# Altium schematic sheet chernov_motherboard.SchDoc: =title_line_1 + title_line_2
size 594 x 420 mm; SheetNumber: 1
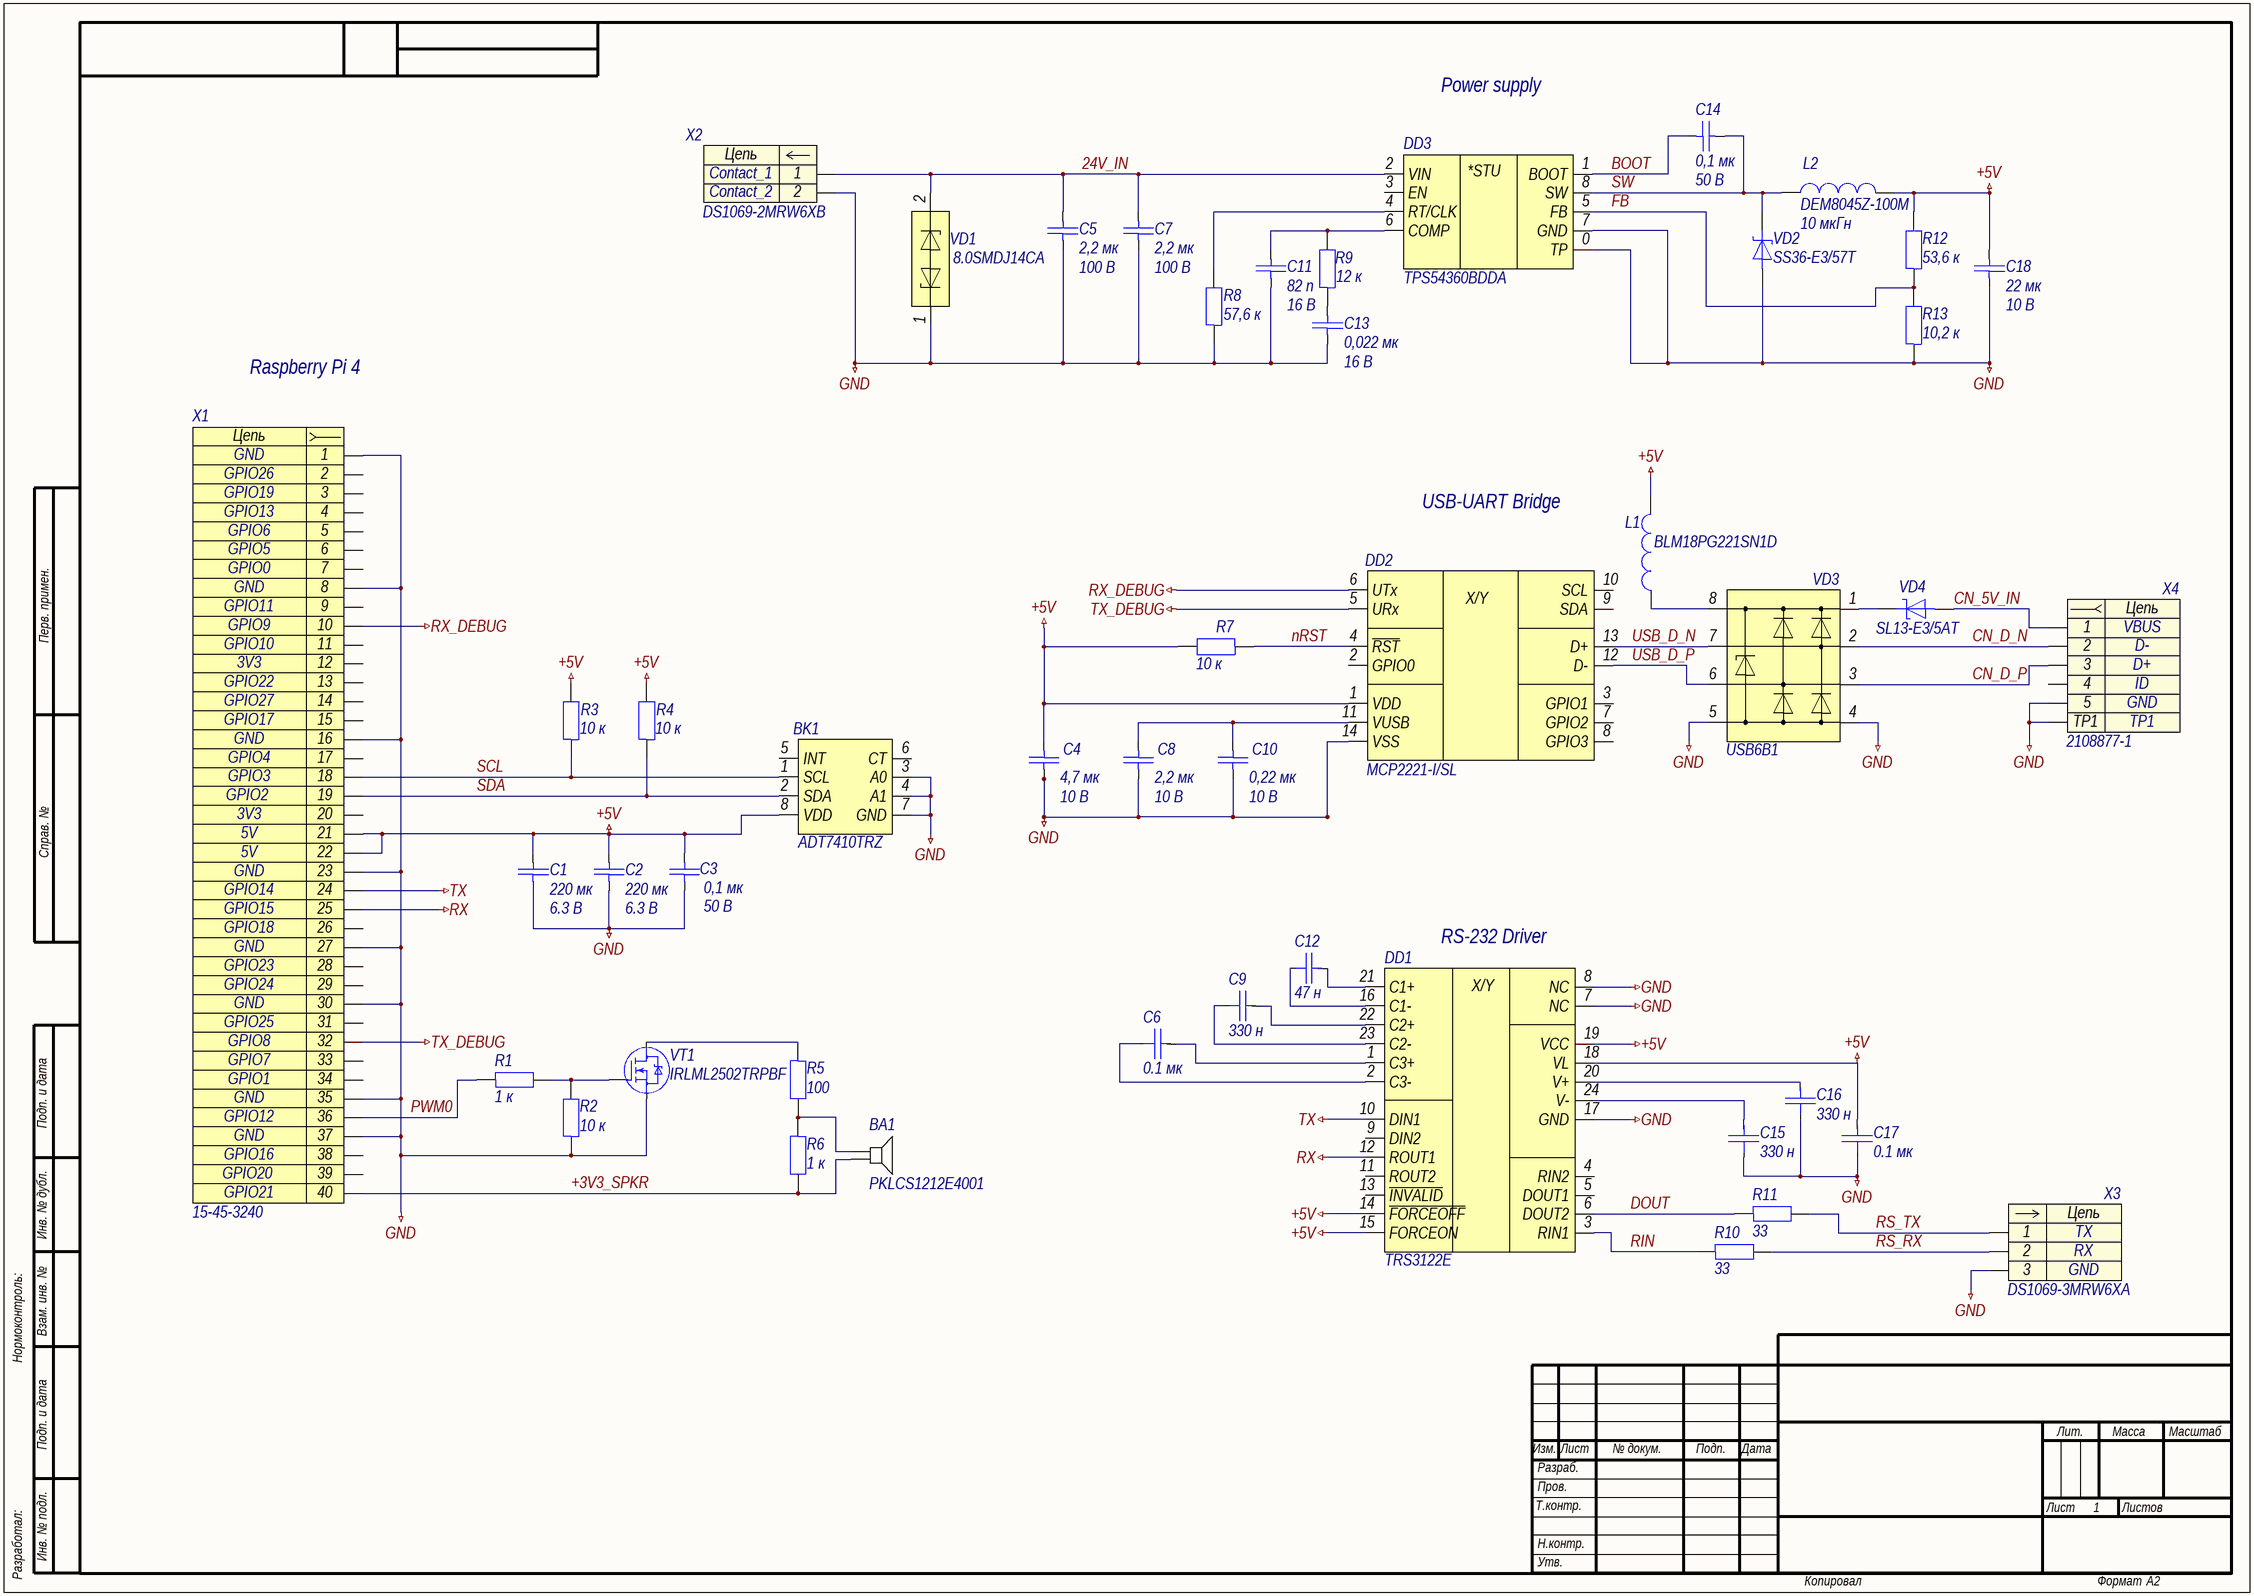
[diagram p0: chernov_motherboard.SchDoc]

## Parts
BA1  PKLCS1212E4001  [PKLCS1212E4001]
BK1  ADT7410TRZ  [SOIC-8-P127-490X390X175-L84X41]
C1  220 мк  Напряжение: 6.3 В  [C1210]
C2  220 мк  Напряжение: 6.3 В  [C1210]
C3  0,1 мк  Напряжение: 50 В  [C0603]
C4  4,7 мк  Напряжение: 10 В  [C0603]
C5  2,2 мк  Напряжение: 100 В  [C1206]
C6  0.1 мк  [C0603]
C7  2,2 мк  Напряжение: 100 В  [C1206]
C8  2,2 мк  Напряжение: 10 В  [C0603]
C9  330 н  [C0805]
C10  0,22 мк  Напряжение: 10 В  [C0603]
C11  82 п  Напряжение: 16 В  [C0603]
C12  47 н  [C0603]
C13  0,022 мк  Напряжение: 16 В  [C0603]
C14  0,1 мк  Напряжение: 50 В  [C0603]
C15  330 н  [C0805]
C16  330 н  [C0805]
C17  0.1 мк  [C0603]
C18  22 мк  Напряжение: 10 В  [C0603]
DD1  TRS3122E  [PQFN_24]
DD2  MCP2221-I/SL  [SOIC127P600X175-14N]
DD3  TPS54360BDDA  [HSOIC-8]
L1  BLM18PG221SN1D  [BLM-2-0603]
L2  DEM8045Z-100M  Индуктивность: 10 мкГн  [DEM-2-800X800X450]
R1  1 к  [R0603]
R2  10 к  [R0603]
R3  10 к  [R0603]
R4  10 к  [R0603]
R5  100  [R0603]
R6  1 к  [R0603]
R7  10 к  [R0603]
R8  57,6 к  [R0603]
R9  12 к  [R0603]
R10  33  [R0603]
R11  33  [R0603]
R12  53,6 к  [R0603]
R13  10,2 к  [R0603]
VD1  8.0SMDJ14CA  [DO-214AB]
VD2  SS36-E3/57T  [DO-214AB]
VD3  USB6B1  [SO-8]
VD4  SL13-E3/5AT  [DO-214AC]
VT1  IRLML2502TRPBF  [SOT-23-3-P95-292X237X112]
X1  15-45-3240  [15-45-3240]
X2  DS1069-2MRW6XB  [DS1069-2MRW6XB]
X3  DS1069-3MRW6XA  [DS1069-3MRW6XA]
X4  2108877-1  [2108877-1]

## Nets
+5V: BK1.8(VDD) C1.1 C2.1 C3.1 C4.2 C17.2 C18.1 DD1.14(~{FORCEOFF}) DD1.15(FORCEON) DD1.18(VL) DD1.19(VCC) DD2.1(VDD) L1.1 L2.2 R3.2 R4.2 R7.2 R12.2 X1.21 X1.22
GND: BK1.3(A0) BK1.4(A1) BK1.7(GND) C1.2 C2.2 C3.2 C4.1 C5.2 C7.2 C8.1 C10.1 C11.2 C13.2 C15.1 C16.1 C17.1 C18.2 DD1.7(NC) DD1.8(NC) DD1.17(GND) DD2.14(VSS) DD3.0(TP) DD3.7(GND) R2.1 R8.1 R13.1 VD1.1 VD2.2 VD3.4 VD3.5 VT1.S X1.1 X1.8 X1.16 X1.23 X1.27 X1.30 X1.35 X1.37 X2.2 X3.3 X4.5 X4.TP1
RX: DD1.12(ROUT1) X1.25
RX_DEBUG: DD2.6(UTx) X1.10
TX: DD1.10(DIN1) X1.24
TX_DEBUG: DD2.5(URx) X1.32
24V_IN: C5.1 C7.1 DD3.2(VIN) VD1.2 X2.1
+3V3_SPKR: BA1.2 R6.2 X1.40
BOOT: C14.2 DD3.1(BOOT)
CN_5V_IN: VD4.2 X4.1
CN_D_N: VD3.2 X4.2
CN_D_P: VD3.3 X4.3
DOUT: DD1.6(DOUT2) R11.1
FB: DD3.5(FB) R12.1 R13.2
nRST: DD2.4(~{RST}) R7.1
PWM0: R1.1 X1.36
RIN: DD1.3(RIN1) R10.1
RS_RX: R10.2 X3.2
RS_TX: R11.2 X3.1
SCL: BK1.1(SCL) R3.1 X1.18
SDA: BK1.2(SDA) R4.1 X1.19
SW: C14.1 DD3.8(SW) L2.1 VD2.1
USB_D_N: DD2.13(D+) VD3.7
USB_D_P: DD2.12(D-) VD3.6
NetBA1_1: BA1.1 R5.2 R6.1
NetC6_1: C6.1 DD1.2(C3-)
NetC6_2: C6.2 DD1.1(C3+)
NetC8_2: C8.2 C10.2 DD2.11(VUSB)
NetC9_1: C9.1 DD1.23(C2-)
NetC9_2: C9.2 DD1.22(C2+)
NetC11_1: C11.1 DD3.6(COMP) R9.2
NetC12_1: C12.1 DD1.16(C1-)
NetC12_2: C12.2 DD1.21(C1+)
NetC13_1: C13.1 R9.1
NetC15_2: C15.2 DD1.24(V-)
NetC16_2: C16.2 DD1.20(V+)
NetDD3_4: DD3.4(RT/CLK) R8.2
NetL1_2: L1.2 VD3.8
NetR1_2: R1.2 R2.2 VT1.G
NetR5_1: R5.1 VT1.D
NetVD3_1: VD3.1 VD4.1

Not connected (* = marked no-connect by the designer): BK1 5(INT) 6(CT); DD1 4(RIN2) 5(DOUT1) 9(DIN2) 11(ROUT2) 13(~{INVALID}); DD2 2(GPIO0) 3(GPIO1) 7(GPIO2) 8(GPIO3) 9(SDA) 10(SCL); DD3 3(EN); X1 2 3 4 5 6 7 9 11 12 13 14 15 17 20 26 28 29 33 34 38 39; X4 4

## Notes on the sheet
- Power supply
- Raspberry Pi 4
- USB-UART Bridge
- (near DD1) RS-232 Driver
- Перв. примен.
- Справ. №
- Подп. и дата
- Инв. № дубл.
- Нормоконтроль:
- Взам. инв. №
- Изм.
- Лист
- № докум.
- Подп.
- Дата
- Лит.
- Масса
- Масштаб
- Т.контр.
- Пров.
- Разраб.
- Листов
- Разработал:
- Инв. № подл.
- Н.контр.
- Утв.
- Копировал
- Формат
- А2
- (in symbol dd0002) *STU
- (in symbol MCP2221-I/SL) X/Y
- (in symbol TRS3122E) X/Y
- (in symbol x0001) Цепь
- (in symbol x0023) Цепь
- (in symbol x0039) Цепь
- (in symbol x0054) Цепь; 31

## Library data of the parts
BA1 = PKLCS1212E4001: Piezoelectric Sounders External Drive SMD Type; URL: http://www.farnell.com/datasheets/2157985.pdf
BK1 = TEMP: 16-бит I2CI цифровой датчик температуры, точность ±0.5°C
C1 C2 = c0158: =Описание; ID: c0158; Фамилия: Шкабара; Описание: Конденсатор керамический чип 1210 220 мкФ 6.3 В ±10 %; Наименование: CC1210KRX5R5BB227; Производитель: YAGEO Corp.; Отклонение: ±10 %; Рабочие температуры: от –55 °С до +85 °С; Температурный коэффициент емкости: X5R; Корпус: 1210; Номинал: 220 мк; Номинальное напряжение: 6.3 В; HelpURL: https://www.yageo.com/upload/media/product/productsearch/datasheet/mlcc/UPY-GPHC_X5R_4V-to-50V_26.pdf
C3 = c0088: =Описание; ID: c0088; Фамилия: Паньков; Описание: Конденсатор керамический чип 0603 100 нФ 50 В ±10 %; Наименование: CC0603KRX7R9BB104; Производитель: YAGEO Corp.; Отклонение: ±10 %; Рабочие температуры: от –55 °С до +125 °С; Температурный коэффициент емкости: X7R; Корпус: 0603; Номинал: 0,1 мк; Номинальное напряжение: 50 В; HelpURL: https://www.yageo.com/upload/media/product/productsearch/datasheet/mlcc/UPY-GPHC_X7R_6.3V-to-50V_20.pdf
C4 = c0012: =Описание; ID: c0012; Фамилия: Чернов; Описание: Конденсатор чип 0603 4,7 мкФ 10 В ±10 %; Наименование: CC0603KRX5R6BB475; Производитель: Yageo; Отклонение: ±10 %; Рабочие температуры: от -55 °С до +85 °С; Корпус: 0603; Номинал: 4,7 мк; Номинальное напряжение: 10 В; HelpURL: https://www.yageo.com/upload/media/product/productsearch/datasheet/mlcc/UPY-GPHC_X5R_4V-to-50V_26.pdf
C5 C7 = c0068: =Описание; ID: c0068; Фамилия: Ларионов; Описание: Конденсатор чип 1206 2,2 мкФ 100 В ±10 %; Наименование: CC1206KKX7R0BB225; Производитель: YAGEO Corp.; Отклонение: ±10 %; Рабочие температуры: от –55 °С до +125 °С; ТКЕ: X7R; Корпус: 1206; Номинал: 2,2 мк; Номинальное напряжение: 100 В; HelpURL: https://www.yageo.com/upload/media/product/productsearch/datasheet/mlcc/UPY-NP0X7R_MV_100-to-630V_22.pdf
C6 C17 = c0002: =Описание; ID: c0002; Фамилия: Жернаков; Описание: Конденсатор; Наименование: CL10B104JB8NNNC; Производитель: Samsung electro-mechanics; Отклонение: ±5 %; Номинальное напряжение: 50 В; Рабочие температуры: от -55 °С до +125 °С; Корпус: 0603; Номинал: 0.1 мк; HelpURL: http://product.samsungsem.com/mlcc/CL10B104JB8NNN.do
C8 = c0009: =Описание; ID: c0009; Фамилия: Чернов; Описание: Конденсатор чип 0603 2,2 мкФ 10 В ±10 %; Наименование: CC0603KRX7R6BB225; Производитель: Yageo; Отклонение: ±10 %; Рабочие температуры: от -55 °С до +125 °С; Корпус: 0603; Номинал: 2,2 мк; Номинальное напряжение: 10 В; HelpURL: https://www.yageo.com/upload/media/product/productsearch/datasheet/mlcc/UPY-GPHC_X7R_6.3V-to-50V_20.pdf
C9 C15 C16 = c0003: =Описание; ID: c0003; Фамилия: Жернаков; Описание: Конденсатор; Наименование: CL21B334KBFNFNE; Производитель: Samsung electro-mechanics; Отклонение: ±10 %; Номинальное напряжение: 50 В; Рабочие температуры: от -55 °С до +125 °С; Корпус: 0805; Номинал: 330 н; HelpURL: http://product.samsungsem.com/mlcc/CL21B334KBFNFN.do
C10 = c0006: =Описание; ID: c0006; Фамилия: Чернов; Описание: Конденсатор чип 0603 0,22 мкФ 10 В ±5 %; Наименование: CC0603JRX7R6BB224; Производитель: Yageo; Отклонение: ±5 %; Рабочие температуры: от -55 °С до +125 °С; Корпус: 0603; Номинал: 0,22 мк; Номинальное напряжение: 10 В; HelpURL: https://www.yageo.com/upload/media/product/productsearch/datasheet/mlcc/UPY-GPHC_X7R_6.3V-to-50V_20.pdf
C11 = c0011: =Описание; ID: c0011; Фамилия: Ларионов; Описание: Конденсатор чип 0603 82 пФ 16 В ±5 %; Наименование: CC0603JRNPO7BN820; Производитель: YAGEO Corp.; Отклонение: ±5 %; Рабочие температуры: от –55 °С до +125 °С; ТКЕ: C0G; Корпус: 0603; Номинал: 82 п; Номинальное напряжение: 16 В; HelpURL: https://www.yageo.com/upload/media/product/productsearch/datasheet/mlcc/UPY-GP_NP0_16V-to-50V_18.pdf
C12 = с0004: =Описание; ID: с0004; Фамилия: Жернаков; Описание: Конденсатор; Наименование: CL10B473JB8NNNC; Производитель: Samsung electro-mechanics; Отклонение: ±5 %; Номинальное напряжение: 50 В; Рабочие температуры: от -55 °С до +125 °С; Корпус: 0603; Номинал: 47 н; HelpURL: http://product.samsungsem.com/mlcc/CL10B473JB8NNN.do
C13 = c0013: =Описание; ID: c0013; Фамилия: Жернаков; Описание: Конденсатор чип 0603 0,022 мкФ 16 В ±10 %; Наименование: CC0201KRX5R7BB223; Производитель: YAGEO Corp.; Отклонение: ±10 %; Рабочие температуры: от -55 °С до +125 °С; Корпус: 0603; Номинал: 0,022 мк; Номинальное напряжение: 16 В; HelpURL: https://www.yageo.com/upload/media/product/productsearch/datasheet/mlcc/UPY-GPHC_X5R_4V-to-50V_26.pdf
C14 = c0027: =Описание; ID: c0027; Фамилия: Паньков; Описание: Конденсатор чип 0603 0,1 мкФ 50 В ±10 %; Наименование: CC0603KRX7R9BB104; Производитель: YAGEO Corp.; Отклонение: ±10 %; Рабочие температуры: от –55 °С до +125 °С; ТКЕ: X7R; Корпус: 0603; Номинал: 0,1 мк; Номинальное напряжение: 50 В; HelpURL: https://www.yageo.com/upload/media/product/products/datasheet/mlcc/UPY-GPHC_X7R_6.3V-to-50V_20.pdf
C18 = c0026: =Описание; ID: c0026; Фамилия: Чернов; Описание: Конденсатор чип 0603 22 мкФ 10 В ±20 %; Наименование: CC0603MPX5R6BB226; Производитель: YAGEO Corp.; Отклонение: ±20 %; Рабочие температуры: от -55 °С до +85 °С; Корпус: 0603; Номинал: 22 мк; Номинальное напряжение: 10 В; HelpURL: https://www.yageo.com/upload/media/product/productsearch/datasheet/mlcc/UPY-GPHC_X5R_4V-to-50V_26.pdf
DD3 = dd0002: =Описание; ID: dd0002; Фамилия: Жернаков; Описание: Понижающий преобразователь напряжения 60 В и 3,5 А; Производитель: Texas Instruments; Входное напряжение: от 4,5 В до 60 В; Выходное напряжение: от 1 В до 58,8 В; Коммутируемый ток: от 0 А до 3,5 А; Частота переключения: от 100 кГц до 2,5 МГц; Рабочие температуры: от -40 °С до +150 °С; Наименование: TPS54360BDDA; Корпус: HSOIC-8; HelpURL: https://www.ti.com/product/TPS54360B#product-details##params
L1 = l0002: =Описание; ID: l0002; Фамилия: Самарин; Описание: Ферритовая бусина 220 Ом ±25 %; Производитель: Murata Manufacturing Co., Ltd.; Сопротивление, 100 МГц: 220 Ом; Отклонение, 100 Мгц: ±25 %; Сопротивление при постоянном токе: 0,1 Ом; Рабочие температуры: от -55 °С до +125 °С; Корпус: 0603; Наименование: BLM18PG221SN1D; HelpURL: https://www.murata.com/en-global/products/productdetail?partno=BLM18PG221SN1%23
L2 = l0012: =Описание; ID: l0012; Фамилия: Паньков; Описание: Катушка индуктивности 10 мкГн ±20 %; Производитель: Murata Manufacturing Co., Ltd.; Отклонение: ±20 %; Номинальное активное сопротивление: 33 мОм; Максимальное активное сопротивление: 39,6 мОм; Резонансная частота: 24 МГц; Номинальный ток (при нагреве на 20 °С/40 °С): 3,9 А; Ток насыщения: 4,3 А; Рабочее напряжение: не указано; Рабочие температуры: от –40 °С до +125 °С; Корпус: 8,0 x 8,0 x 4,5; Наименование: DEM8045Z-100M; Номинал: 10 мкГн; HelpURL: https://www.murata.com/en-us/products/productdetail?partno=DEM8045Z-100M%23
R1 R6 = r0076: =Описание; ID: r0076; Фамилия: Ларионов; Описание: Резистор чип 0603 1 кОм ±1 % 0,1 Вт; Наименование: RC0603FR-071KL; Производитель: YAGEO Corp.; Отклонение: ±1 %; Номинальное напряжение: 75 В; Номинальный ток: 1 А; Рабочие температуры: от –55 °С до +155 °С; Корпус: 0603; Примечание: Ряд E24; Номинал: 1 к; HelpURL: https://www.yageo.com/upload/media/product/productsearch/datasheet/rchip/PYu-RC_Group_51_RoHS_L_11.pdf
R2-R4 = r0105: =Описание; ID: r0105; Фамилия: Самарин; Описание: Резистор чип 0603 10 кОм ±1 % 0,1 Вт; Наименование: RC0603FR-0710KL; Производитель: YAGEO Corp.; Отклонение: ±1 %; Номинальное напряжение: 75 В; Номинальный ток: 1 А; Рабочие температуры: от –55 °С до +155 °С; Корпус: 0603; Примечание: Ряд E24; Номинал: 10 к; HelpURL: https://www.yageo.com/upload/media/product/productsearch/datasheet/rchip/PYu-RC_Group_51_RoHS_L_11.pdf
R5 = r0052: =Описание; ID: r0052; Фамилия: Самарин; Описание: Резистор чип 0603 100 Ом ±1 % 0,1 Вт; Наименование: RC0603FR‍‐07100RL; Производитель: YAGEO Corp.; Отклонение: ±1 %; Номинальное напряжение: 75 В; Номинальный ток: 1 А; Рабочие температуры: от –55 °С до +155 °С; Корпус: 0603; Примечание: Ряд E24; Номинал: 100; HelpURL: https://www.yageo.com/upload/media/product/productsearch/datasheet/rchip/PYu-RC_Group_51_RoHS_L_11.pdf
R7 = r0012: =Описание; ID: r0012; Фамилия: Самарин; Описание: Резистор чип 0603 10 кОм ±1 % 0,1 Вт; Наименование: RC0603FR-0710KL; Производитель: Yageo; Отклонение: ±1 %; Номинальное напряжение: 75 В; Рабочие температуры: от -55 °С до +155 °С; Номинальный ток: 1 А; Корпус: 0603; Номинал: 10 к; HelpURL: https://www.yageo.com/upload/media/product/productsearch/datasheet/rchip/PYu-RC_Group_51_RoHS_L_11.pdf
R8 = r0089: =Описание; ID: r0089; Фамилия: Ларионов; Описание: Резистор чип 0603 57,6 кОм ±1 % 0,1 Вт; Наименование: RC0603FR-0757K6L; Производитель: YAGEO Corp.; Отклонение: ±1 %; Номинальное напряжение: 75 В; Номинальный ток: 1 А; Рабочие температуры: от –55 °С до +155 °С; Корпус: 0603; Номинал: 57,6 к; HelpURL: https://www.yageo.com/upload/media/product/productsearch/datasheet/rchip/PYu-RC_Group_51_RoHS_L_11.pdf
R9 = r0063: =Описание; ID: r0063; Фамилия: Паньков; Описание: Резистор чип 0603 12 кОм ±1 % 0,1 Вт; Наименование: RC0603FR-0712KL; Производитель: YAGEO Corp.; Отклонение: ±1 %; Номинальное напряжение: 75 В; Номинальный ток: 1 А; Рабочие температуры: от –55 °С до +155 °С; Корпус: 0603; Примечание: Ряд E24; Номинал: 12 к; HelpURL: https://www.yageo.com/upload/media/product/productsearch/datasheet/rchip/PYu-RC_Group_51_RoHS_L_11.pdf
R10 R11 = r0006: =Описание; ID: r0006; Фамилия: Жернаков; Описание: Резистор 33 Ом; Наименование: RC0603F330CS; Производитель: Samsung; Отклонение: ±1 %; Номинальное напряжение: 25 В; Рабочие температуры: от -55 °С до +150 °С; Номинальный ток: 0,5 А; Корпус: 0603; Номинал: 33; HelpURL: http://product.samsungsem.com/cr/RC0603F330CS.do
R12 = r0017: =Описание; ID: r0017; Фамилия: Жернаков; Описание: Резистор чип 0603 53,6 кОм ±0,1 % 0,1 Вт; Наименование: RC0603BR-0753K6L; Производитель: YAGEO Corp.; Отклонение: ±0,1 %; Номинальное напряжение: 75 В; Рабочие температуры: от -55 °С до +155 °С; Номинальный ток: 1 А; Корпус: 0603; Номинал: 53,6 к; HelpURL: https://www.yageo.com/upload/media/product/productsearch/datasheet/rchip/PYu-RC_Group_51_RoHS_L_11.pdf
R13 = r0014: =Описание; ID: r0014; Фамилия: Жернаков; Описание: Резистор чип 0603 10,2 кОм ±1 % 0,1 Вт; Наименование: RC0603FR-0710K2L; Производитель: YAGEO Corp.; Отклонение: ±1 %; Номинальное напряжение: 75 В; Рабочие температуры: от -55 °С до +155 °С; Номинальный ток: 1 А; Корпус: 0603; Номинал: 10,2 к; HelpURL: https://www.yageo.com/upload/media/product/productsearch/datasheet/rchip/PYu-RC_Group_51_RoHS_L_11.pdf
VD1 = vd0004: =Описание; ID: vd0004; Фамилия: Шкабара; Описание: Двунаправленная диодная сборка для подавления помех, 14 В; Производитель: Littelfuse, Inc.; Наименование: 8.0SMDJ14CA; Корпус: DO-214AB; HelpURL: https://www.littelfuse.com/products/tvs-diodes/surface-mount/8.0smdj.aspx
VD2 = vd0003: =Описание; ID: vd0003; Фамилия: Жернаков; Описание: Диод Шоттки 60 В 3 А; Производитель: Vishay Intertechnology, Inc.; Пиковое прямое напряжение: 0,75 В; Импульсное обратное напряжение: 60 В; Макс допустимый средний прямой ток: 3 А; Рабочие температуры: от –55 °С до +150 °С; Наименование: SS36-E3/57T; Корпус: DO-214AB; HelpURL: https://www.vishay.com/product?docid=88751
VD3 = vd0005: =Описание; ID: vd0005; Фамилия: Ларионов; Описание: Диодная сборка для подавления помех, от 6 В; Производитель: STMicroelectronics; Наименование: USB6B1; Корпус: SO-8; HelpURL: https://www.st.com/content/st_com/en/products/protection-devices/esd-protection/usb-port-protection/usb6b1.html
VD4 = vd0001: =Описание; ID: vd0001; Фамилия: Ларионов; Описание: Диод Шоттки 30 В 1,5 А; Производитель: Vishay Intertechnology, Inc.; Пиковое прямое напряжение: 0,445 В; Импульсное обратное напряжение: 30 В; Макс допустимый средний прямой ток: 1,5 А; Рабочие температуры: от -55 °С до +125 °С; Наименование: SL13-E3/5AT; Корпус: DO-214AC; HelpURL: https://www.vishay.com/product?docid=88740
VT1 = vt0006: =Описание; ID: vt0006; Фамилия: Паньков; Описание: Полевой N-канальный МДП-транзистор 20 В 4,2 А; Производитель: Infineon Technologies AG; Напряжение затвор — исток: ±12 В; Напряжение сток — исток: 20 В; Ток стока: 4,2 А; Сопротивление сток — исток: 80 мОм; Рабочие температуры: от –55 °С до +150 °С; Корпус: SOT-23-3; Наименование: IRLML2502TRPBF; HelpURL: https://www.infineon.com/cms/en/product/power/mosfet/12v-300v-n-channel-power-mosfet/irlml2502/
X1 = x0054: =Описание; Contact_1: GND; Contact_2: GPIO26; Contact_3: GPIO19; Contact_4: GPIO13; Contact_5: GPIO6; Contact_6: GPIO5; Contact_7: GPIO0; Contact_9: GPIO11; Contact_10: GPIO9; Contact_11: GPIO10; Contact_12: 3V3; Contact_13: GPIO22; Contact_14: GPIO27; Contact_15: GPIO17; Contact_17: GPIO4; Contact_18: GPIO3; Contact_19: GPIO2; Contact_21: 5V; Contact_24: GPIO14; Contact_25: GPIO15; Contact_26: GPIO18; Contact_28: GPIO23; Contact_29: GPIO24; Contact_31: GPIO25; Contact_32: GPIO8; Contact_33: GPIO7; Contact_34: GPIO1; Contact_36: GPIO12; Contact_38: GPIO16; Contact_39: GPIO20; Contact_40: GPIO21; ID: x0054; Фамилия: Козлов; Описание: C-Grid 40 pin 2,54 мм гнездо прямой; Производитель: Molex; Contact_8: GND; Contact_16: GND; Contact_20: 3V3; Contact_22: 5V; Contact_23: GND; Contact_27: GND; Contact_30: GND; Contact_35: GND; Contact_37: GND; Наименование: 15-45-3240; HelpURL: https://www.molex.com/molex/products/part-detail/pcb_receptacles/0015453240
X2 = x0039: =Описание; ID: x0039; Фамилия: Ларионов; Описание: CWF 2 pin Type B 2,5 мм вилка угловой; Производитель: Connfly Electronic Co., Ltd.; Contact_1: Contact_1; Contact_2: Contact_2; Наименование: DS1069-2MRW6XB; HelpURL: http://en.connfly.group/product/xVkr=EusQssAN0gN=Aos=mU+UrVkR9kqEAN0gN0MUR+g+NB+A
X3 = x0023: =Описание; Contact_1: TX; Contact_2: RX; Contact_3: GND; ID: x0023; Фамилия: Паньков; Описание: CWF 3 pin Type A 2,5 мм вилка угловой; Производитель: Connfly Electronic Co., Ltd.; Наименование: DS1069-3MRW6XA; HelpURL: http://en.connfly.group/product/xVkr=EusQssAN0gN=Aos=mU+UrVkR9kqEAN0gN0MUR+g+NB+A
X4 = x0001: =Описание; Contact_1: VBUS; Contact_2: D-; Contact_3: D+; Contact_4: ID; Contact_5: GND; ID: x0001; Фамилия: Ларионов; Описание: Micro USB Type B IP68 гнездо; Производитель: TE Connectivity; Наименование: 2108877-1; HelpURL: https://www.te.com/global-en/product-2108877-1.html